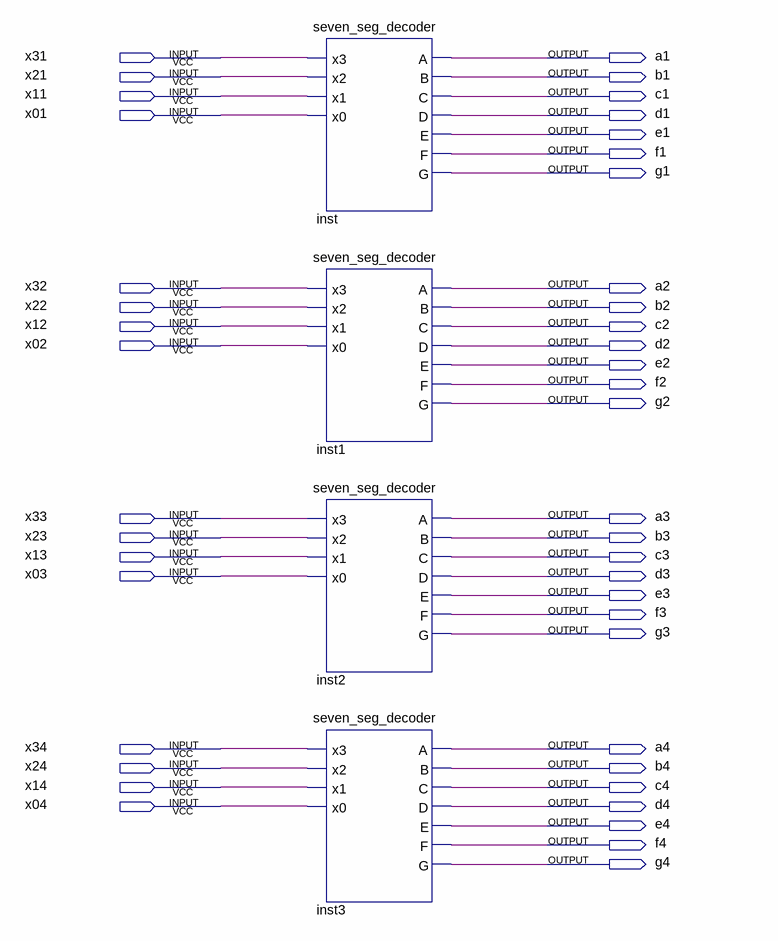
[diagram p0: schematic sheet]
// Quartus schematic lab5step1.bdf as structural Verilog: 4 symbols, 44 pins
module lab5step1 (
  input  x31,
  input  x21,
  input  x11,
  input  x01,
  input  x32,
  input  x22,
  input  x12,
  input  x02,
  input  x33,
  input  x23,
  input  x13,
  input  x03,
  input  x34,
  input  x24,
  input  x14,
  input  x04,
  output a1,
  output b1,
  output c1,
  output d1,
  output e1,
  output f1,
  output g1,
  output a2,
  output b2,
  output c2,
  output d2,
  output e2,
  output f2,
  output g2,
  output a3,
  output b3,
  output c3,
  output d3,
  output e3,
  output f3,
  output g3,
  output a4,
  output b4,
  output c4,
  output d4,
  output e4,
  output f4,
  output g4
);

  seven_seg_decoder inst (
    .x3(x31), .x2(x21), .x1(x11), .x0(x01), .A(a1), .B(b1), .C(c1), .D(d1), .E(e1), .F(f1), .G(g1));
  seven_seg_decoder inst1 (
    .x3(x32), .x2(x22), .x1(x12), .x0(x02), .A(a2), .B(b2), .C(c2), .D(d2), .E(e2), .F(f2), .G(g2));
  seven_seg_decoder inst2 (
    .x3(x33), .x2(x23), .x1(x13), .x0(x03), .A(a3), .B(b3), .C(c3), .D(d3), .E(e3), .F(f3), .G(g3));
  seven_seg_decoder inst3 (
    .x3(x34), .x2(x24), .x1(x14), .x0(x04), .A(a4), .B(b4), .C(c4), .D(d4), .E(e4), .F(f4), .G(g4));
endmodule
